# Altium project PCB_trainning.PrjPCB
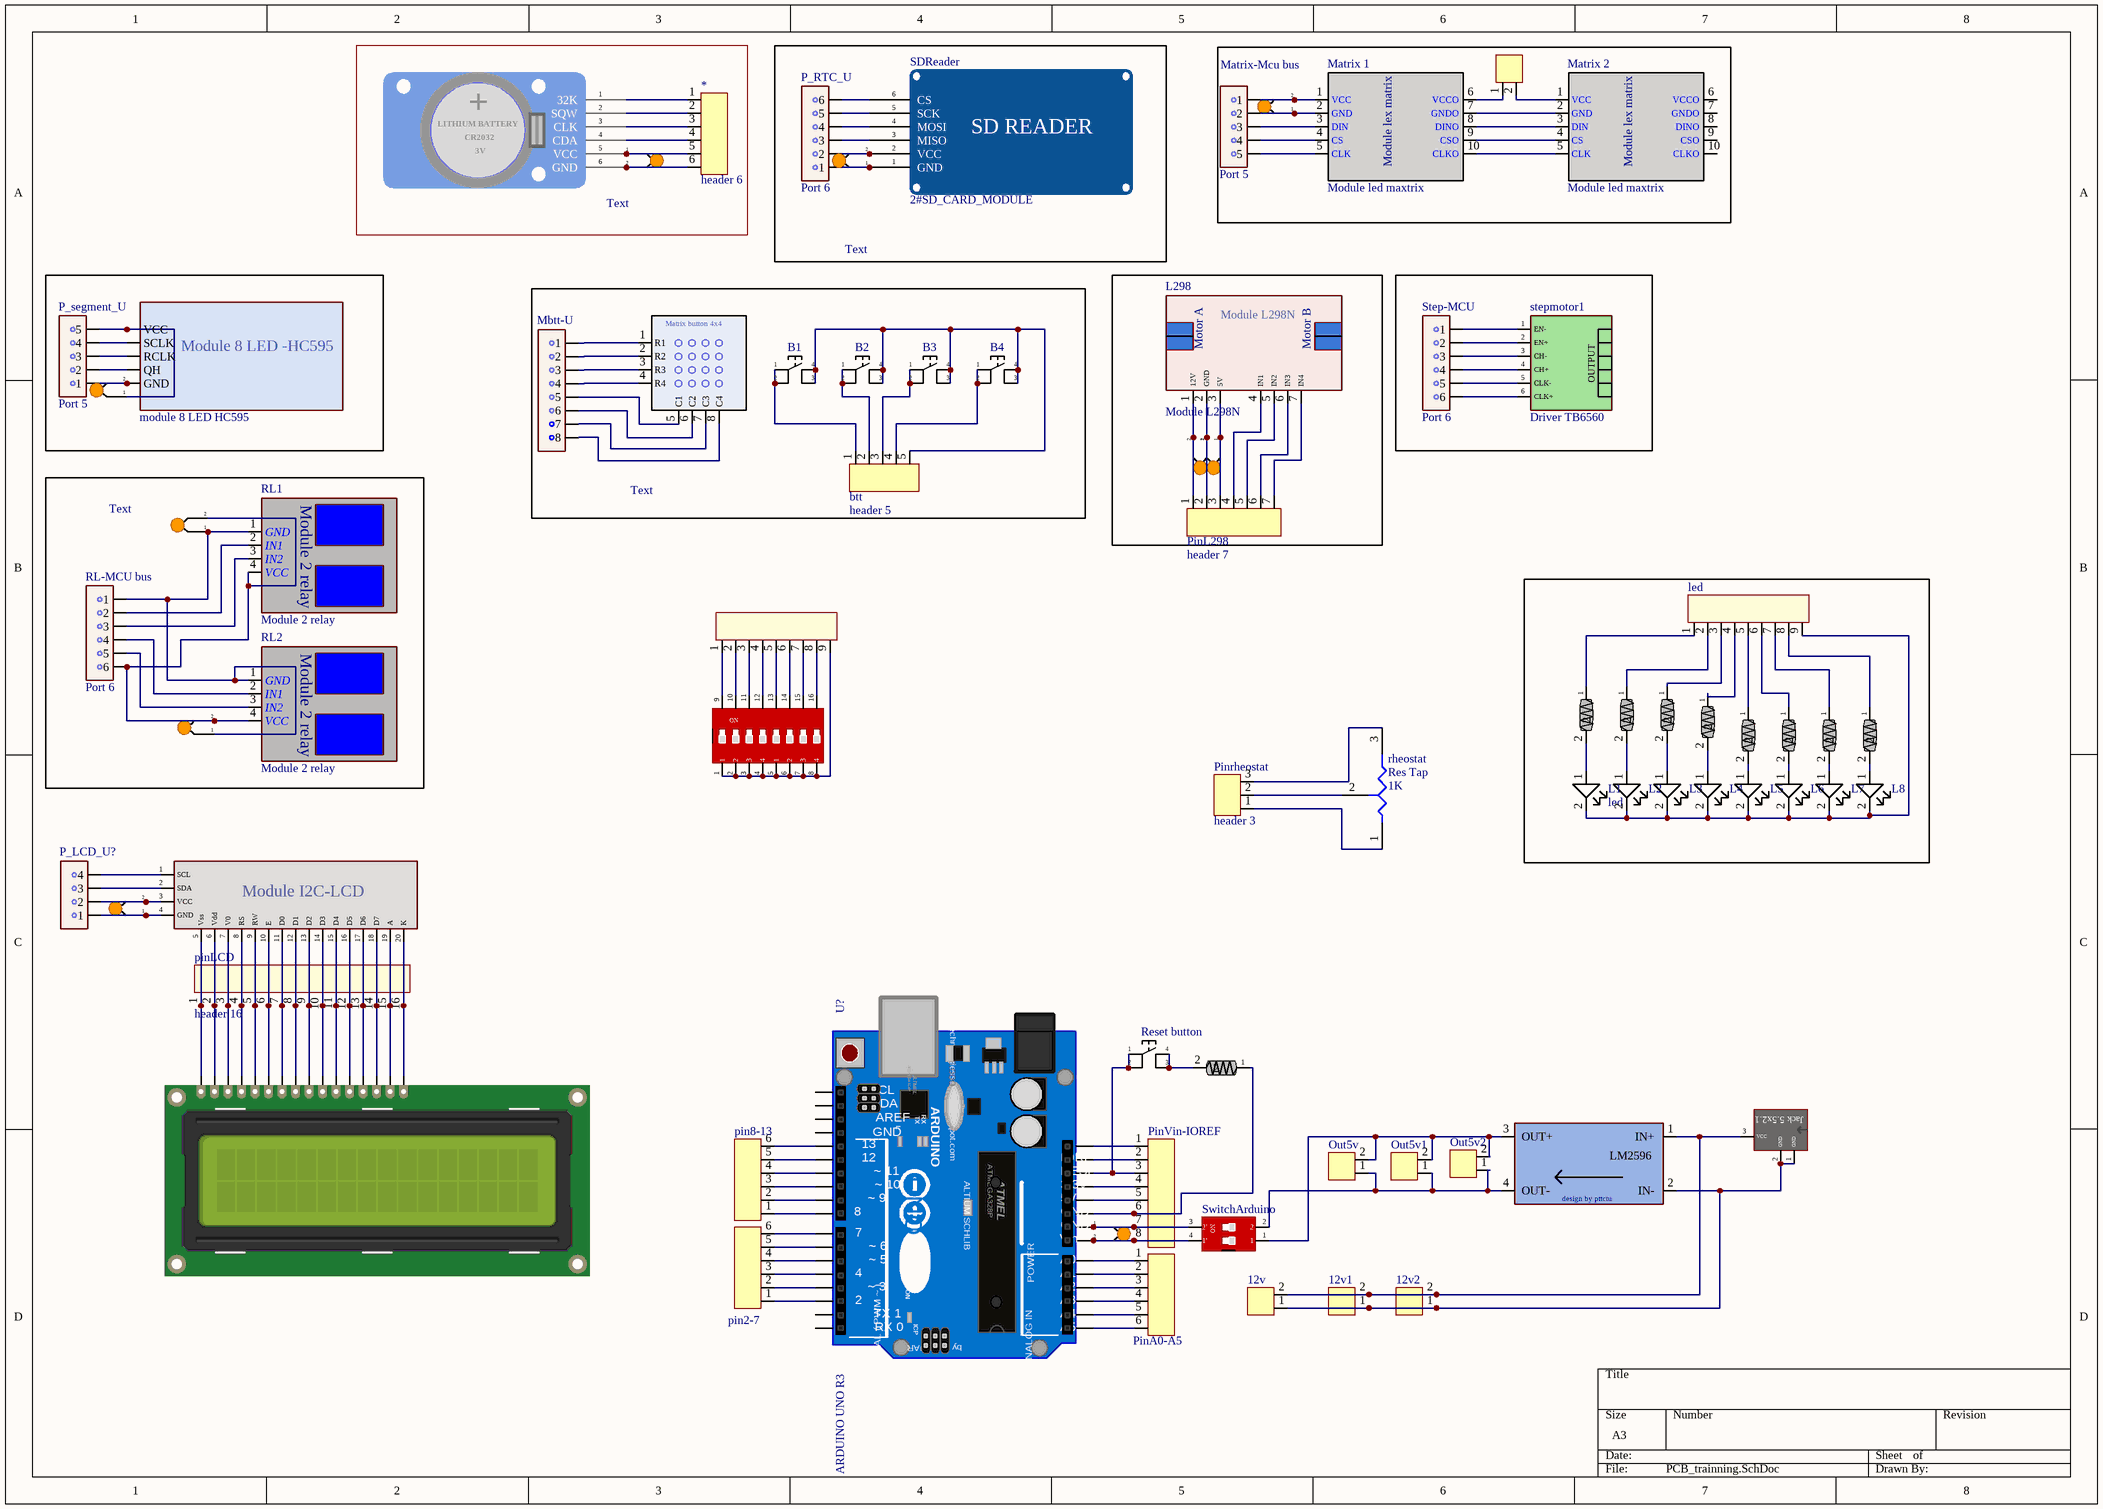
[diagram p0: PCB_trainning.SchDoc]
1 sheet, 75 parts. Net scope: global (net labels, ports and power ports of the same name join across sheets).
Board file: PCB_trainning.PcbDoc

## Sheet PCB_trainning.SchDoc
size A3

### Parts
12v  Header 2  [header2-male]  (value not drawn)
12v1  Header 2  [header2-male]  (value not drawn)
12v2  Header 2  [header2-male]  (value not drawn)
*  header 6  [header6-male]
?  module 8 LED HC595  [8 led 7 doan]
B1  5#Button  [5#Button]  (value not drawn)
B2  5#Button  [5#Button]  (value not drawn)
B3  5#Button  [5#Button]  (value not drawn)
B4  5#Button  [5#Button]  (value not drawn)
btt  header 5  [header 5- male]
connect_matrix  Header 2  [header2-male]  (value not drawn)
Converter  LM2596  [LM2596]  (value not drawn)
I2C?  Module LCD I2C  [module I2C]  (value not drawn)
L1  led  [led 5mm]
L2  led  [led 5mm]  (value not drawn)
L3  led  [led 5mm]  (value not drawn)
L4  led  [led 5mm]  (value not drawn)
L5  led  [led 5mm]  (value not drawn)
L6  led  [led 5mm]  (value not drawn)
L7  led  [led 5mm]  (value not drawn)
L8  led  [led 5mm]  (value not drawn)
L298  Module L298N  [L298N]
LCD?  JHD16A  [LCD-I2C]  (value not drawn)
led  header 9_male  [header 9]  (value not drawn)
loc  4#Cap2  [4#Cap2]  (value not drawn)
loc2  4#Cap2  [4#Cap2]  (value not drawn)
loc3  4#Cap2  [4#Cap2]  (value not drawn)
loc4  4#Cap2  [4#Cap2]  (value not drawn)
loc5  4#Cap2  [4#Cap2]  (value not drawn)
loc6  4#Cap2  [4#Cap2]  (value not drawn)
loc7  4#Cap2  [4#Cap2]  (value not drawn)
loc8  4#Cap2  [4#Cap2]  (value not drawn)
loc9  4#Cap2  [4#Cap2]  (value not drawn)
loc10  4#Cap2  [4#Cap2]  (value not drawn)
Matrix-Mcu_bus  Port 5  [header 5- male]
Matrix_1  Module led maxtrix  [8*8 LED MATRIX]
Matrix_2  Module led maxtrix  [8*8 LED MATRIX]
Matrix_button  Matrix button 4x4  [matrix btt]  (value not drawn)
Mbtt-U  port 8  [Header8-male]  (value not drawn)
Out5v  Header 2  [header2-male]  (value not drawn)
Out5v1  Header 2  [header2-male]  (value not drawn)
Out5v2  Header 2  [header2-male]  (value not drawn)
P_LCD_U?  Port 4  [Header 4-male]  (value not drawn)
P_RTC_U  Port 6  [header6-male]
P_segment_U  Port 5  [header 5- male]
pin2-7  header 6  [header6-male]  (value not drawn)
pin8-13  header 6  [header6-male]  (value not drawn)
pin-switch_8  header 9_male  [header 9]  (value not drawn)
PinA0-A5  header 6  [header6-male]  (value not drawn)
PinL298  header 7  [header7-male]
pinLCD  header 16  [header 16]
Pinrheostat  header 3  [Header3-male]
PinVin-IOREF  Header 8  [Header8-male]  (value not drawn)
Power_supply  5#DC Jack 2.54mm  [5#DC Jack 2.54mm]  (value not drawn)
R1  Res  [Res]  (value not drawn)
R2  Res  [Res]  (value not drawn)
R3  Res  [Res]  (value not drawn)
R4  Res  [Res]  (value not drawn)
R5  Res  [Res]  (value not drawn)
R6  Res  [Res]  (value not drawn)
R7  Res  [Res]  (value not drawn)
R8  Res  [Res]  (value not drawn)
Reset_button  5#Button  [5#Button]  (value not drawn)
Reset_res  Res  [Res]  (value not drawn)
rheostat  Res Tap  value 1K  [Rheostat]
RL1  Module 2 relay  [Module 2RL1]
RL2  Module 2 relay  [Module 2RL1]
RL-MCU_bus  Port 6  [header6-male]
RTC  2#RTC_DS3231  [2#RTC_DS3231]  (value not drawn)
SDReader  2#SD_CARD_MODULE  [2#SD_READER]
Step-MCU  Port 6  [header6-male]
stepmotor1  Driver TB6560  [Driver step motor TP6560]
Switch_8  Switch 8  [switch-bit8]  (value not drawn)
SwitchArduino  5#Bit_Switch_2  [5#Bit_Switch_2]  (value not drawn)
U?  ARDUINO UNO R3  [ARDUINO UNO R3 ORG]

### Blocks framed on the sheet
Text: * loc2 RTC
Text: loc4 P_RTC_U SDReader
Text: B1-B4 btt Matrix_button Mbtt-U
Text: loc6 loc7 RL1 RL2 RL-MCU_bus

### Nets
Net12v_1: 12v.1 12v1.1 12v2.1 Converter.2(IN-) Power_supply.1(GND) Power_supply.2(GND)
Net12v_2: 12v.2 12v1.2 12v2.2 Converter.1(IN+) Power_supply.3(VCC)
Net*_1: *.1 RTC.1(32K)
Net*_2: *.2 RTC.2(SQW)
Net*_3: *.3 RTC.3(CLK)
Net*_4: *.4 RTC.4(CDA)
Net*_5: *.5 loc2.1 RTC.5(VCC)
Net*_6: *.6 loc2.2 RTC.6(GND)
Net?_1: ?.1(VCC) loc3.1 P_segment_U.5
Net?_2: ?.2(SCLK) P_segment_U.4
Net?_3: ?.3(RCLK) P_segment_U.3
Net?_4: ?.4(QH) P_segment_U.2
Net?_5: ?.5(GND) loc3.2 P_segment_U.1
NetB1_1: B1.1 B1.2 btt.1
NetB1_3: B1.3 B1.4 B2.3 B2.4 B3.3 B3.4 B4.3 B4.4 btt.5
NetB2_1: B2.1 B2.2 btt.2
NetB3_1: B3.1 B3.2 btt.3
NetB4_1: B4.1 B4.2 btt.4
Netconnect_matrix_1: connect_matrix.1 Matrix_1.6(VCCO)
Netconnect_matrix_2: connect_matrix.2 Matrix_2.1(VCC)
NetConverter_3: Converter.3(OUT+) Out5v.2 Out5v1.2 Out5v2.2 SwitchArduino.1
NetConverter_4: Converter.4(OUT-) Out5v.1 Out5v1.1 Out5v2.1 SwitchArduino.2
NetI2C?_1: I2C?.1(SCL) P_LCD_U?.4
NetI2C?_2: I2C?.2(SDA) P_LCD_U?.3
NetI2C?_3: I2C?.3(VCC) loc8.2 P_LCD_U?.2
NetI2C?_4: I2C?.4(GND) loc8.1 P_LCD_U?.1
NetI2C?_5: I2C?.5(Vss) LCD?.1(GND) pinLCD.1
NetI2C?_6: I2C?.6(Vdd) LCD?.2(VCC) pinLCD.2
NetI2C?_7: I2C?.7(V0) LCD?.3(VDD) pinLCD.3
NetI2C?_8: I2C?.8(RS) LCD?.4(RS) pinLCD.4
NetI2C?_9: I2C?.9(RW) LCD?.5(RAW) pinLCD.5
NetI2C?_10: I2C?.10(E) LCD?.6(E) pinLCD.6
NetI2C?_11: I2C?.11(D0) LCD?.7(D0) pinLCD.7
NetI2C?_12: I2C?.12(D1) LCD?.8(D1) pinLCD.8
NetI2C?_13: I2C?.13(D2) LCD?.9(D2) pinLCD.9
NetI2C?_14: I2C?.14(D3) LCD?.10(D3) pinLCD.10
NetI2C?_15: I2C?.15(D4) LCD?.11(D4) pinLCD.11
NetI2C?_16: I2C?.16(D5) LCD?.12(D5) pinLCD.12
NetI2C?_17: I2C?.17(D6) LCD?.13(D6) pinLCD.13
NetI2C?_18: I2C?.18(D7) LCD?.14(D7) pinLCD.14
NetI2C?_19: I2C?.19(A) LCD?.15(BL_(+)) pinLCD.15
NetI2C?_20: I2C?.20(K) LCD?.16(BL_(-)) pinLCD.16
NetL1_1: L1.1(A) R1.2
NetL1_2: L1.2(K) L2.2(K) L3.2(K) L4.2(K) L5.2(K) L6.2(K) L7.2(K) L8.2(K) led.9
NetL2_1: L2.1(A) R2.2
NetL3_1: L3.1(A) R3.2
NetL4_1: L4.1(A) R4.2
NetL5_1: L5.1(A) R5.2
NetL6_1: L6.1(A) R6.2
NetL7_1: L7.1(A) R7.2
NetL8_1: L8.1(A) R8.2
NetL298_1: L298.1(12V) loc9.2 PinL298.1
NetL298_2: L298.2(GND) loc9.1 loc10.2 PinL298.2
NetL298_3: L298.3(5V) loc10.1 PinL298.3
NetL298_4: L298.4(IN1) PinL298.4
NetL298_5: L298.5(IN2) PinL298.5
NetL298_6: L298.6(IN3) PinL298.6
NetL298_7: L298.7(IN4) PinL298.7
Netled_1: led.1 R1.1
Netled_2: led.2 R2.1
Netled_3: led.3 R3.1
Netled_4: led.4 R4.1
Netled_5: led.5 R5.1
Netled_6: led.6 R6.1
Netled_7: led.7 R7.1
Netled_8: led.8 R8.1
Netloc4_1: loc4.1 P_RTC_U.1 SDReader.1(GND)
Netloc4_2: loc4.2 P_RTC_U.2 SDReader.2(VCC)
Netloc5_1: loc5.1 Matrix-Mcu_bus.2 Matrix_1.2(GND)
Netloc5_2: loc5.2 Matrix-Mcu_bus.1 Matrix_1.1(VCC)
Netloc6_1: loc6.1 loc7.1 RL1.1(GND) RL2.1(GND) RL-MCU_bus.1
Netloc6_2: loc6.2 loc7.2 RL1.4(VCC) RL2.4(VCC) RL-MCU_bus.6
Netloc_1: loc.1 PinVin-IOREF.7 SwitchArduino.3(2') U?.19(GND)
Netloc_2: loc.2 PinVin-IOREF.8 SwitchArduino.4(1') U?.18(Vin)
NetMatrix-Mcu_bus_3: Matrix-Mcu_bus.3 Matrix_1.3(DIN)
NetMatrix-Mcu_bus_4: Matrix-Mcu_bus.4 Matrix_1.4(CS)
NetMatrix-Mcu_bus_5: Matrix-Mcu_bus.5 Matrix_1.5(CLK)
NetMatrix_1_7: Matrix_1.7(GNDO) Matrix_2.2(GND)
NetMatrix_1_8: Matrix_1.8(DINO) Matrix_2.3(DIN)
NetMatrix_1_9: Matrix_1.9(CSO) Matrix_2.4(CS)
NetMatrix_1_10: Matrix_1.10(CLKO) Matrix_2.5(CLK)
NetMatrix_button_1: Matrix_button.1(R1) Mbtt-U.1
NetMatrix_button_2: Matrix_button.2(R2) Mbtt-U.2
NetMatrix_button_3: Matrix_button.3(R3) Mbtt-U.3
NetMatrix_button_4: Matrix_button.4(R4) Mbtt-U.4
NetMatrix_button_5: Matrix_button.5(C1) Mbtt-U.5
NetMatrix_button_6: Matrix_button.6(C2) Mbtt-U.6
NetMatrix_button_7: Matrix_button.7(C3) Mbtt-U.7
NetMatrix_button_8: Matrix_button.8(C4) Mbtt-U.8
NetP_RTC_U_3: P_RTC_U.3 SDReader.3(MISO)
NetP_RTC_U_4: P_RTC_U.4 SDReader.4(MOSI)
NetP_RTC_U_5: P_RTC_U.5 SDReader.5(SCK)
NetP_RTC_U_6: P_RTC_U.6 SDReader.6(CS)
Netpin2-7_1: pin2-7.1 U?.2
Netpin2-7_2: pin2-7.2 U?.3(~_3)
Netpin2-7_3: pin2-7.3 U?.4
Netpin2-7_4: pin2-7.4 U?.5(~_5)
Netpin2-7_5: pin2-7.5 U?.6(~_6)
Netpin2-7_6: pin2-7.6 U?.7
Netpin8-13_1: pin8-13.1 U?.8
Netpin8-13_2: pin8-13.2 U?.9(~_9)
Netpin8-13_3: pin8-13.3 U?.10(~_10)
Netpin8-13_4: pin8-13.4 U?.11(~_11)
Netpin8-13_5: pin8-13.5 U?.12
Netpin8-13_6: pin8-13.6 U?.13
Netpin-switch_8_1: pin-switch_8.1 Switch_8.9
Netpin-switch_8_2: pin-switch_8.2 Switch_8.10
Netpin-switch_8_3: pin-switch_8.3 Switch_8.11
Netpin-switch_8_4: pin-switch_8.4 Switch_8.12
Netpin-switch_8_5: pin-switch_8.5 Switch_8.13
Netpin-switch_8_6: pin-switch_8.6 Switch_8.14
Netpin-switch_8_7: pin-switch_8.7 Switch_8.15
Netpin-switch_8_8: pin-switch_8.8 Switch_8.16
Netpin-switch_8_9: pin-switch_8.9 Switch_8.1 Switch_8.2 Switch_8.3 Switch_8.4 Switch_8.5(1) Switch_8.6(2) Switch_8.7(3) Switch_8.8(4)
NetPinA0-A5_1: PinA0-A5.1 U?.A0
NetPinA0-A5_2: PinA0-A5.2 U?.A1
NetPinA0-A5_3: PinA0-A5.3 U?.A2
NetPinA0-A5_4: PinA0-A5.4 U?.A3
NetPinA0-A5_5: PinA0-A5.5 U?.A4
NetPinA0-A5_6: PinA0-A5.6 U?.A5
NetPinrheostat_1: Pinrheostat.1 rheostat.1(A)
NetPinrheostat_2: Pinrheostat.2 rheostat.2(TAP)
NetPinrheostat_3: Pinrheostat.3 rheostat.3(B)
NetPinVin-IOREF_1: PinVin-IOREF.1 U?.25
NetPinVin-IOREF_2: PinVin-IOREF.2 U?.24(IOREF)
NetPinVin-IOREF_3: PinVin-IOREF.3 Reset_button.1 Reset_button.2 U?.23(RESET)
NetPinVin-IOREF_4: PinVin-IOREF.4 U?.22(3.3V)
NetPinVin-IOREF_5: PinVin-IOREF.5 U?.21(5V)
NetPinVin-IOREF_6: PinVin-IOREF.6 Reset_res.1 U?.20(GND)
NetReset_button_3: Reset_button.3 Reset_button.4 Reset_res.2
NetRL1_2: RL1.2(IN1) RL-MCU_bus.2
NetRL1_3: RL1.3(IN2) RL-MCU_bus.3
NetRL2_2: RL2.2(IN1) RL-MCU_bus.4
NetRL2_3: RL2.3(IN2) RL-MCU_bus.5
NetStep-MCU_1: Step-MCU.1 stepmotor1.1(EN-)
NetStep-MCU_2: Step-MCU.2 stepmotor1.2(EN+)
NetStep-MCU_3: Step-MCU.3 stepmotor1.3(CH-)
NetStep-MCU_4: Step-MCU.4 stepmotor1.4(CH+)
NetStep-MCU_5: Step-MCU.5 stepmotor1.5(CLK-)
NetStep-MCU_6: Step-MCU.6 stepmotor1.6(CLK+)

Not connected (* = marked no-connect by the designer): Matrix_2 6(VCCO) 7(GNDO) 8(DINO) 9(CSO) 10(CLKO); U? 0(RX_0) 1(TX_1) 14(GND) 15(AREF) 16(SDA) 17(SCL)

### Notes on the sheet
- (in symbol 2#RTC_DS3231) LITHIUM BATTERY; +; CR2032; 3V
- (in symbol 2#SD_CARD_MODULE) SD READER
- (in symbol 5#Bit_Switch_2) ON
- (in symbol 5#DC Jack 2.54mm) Jack 5.5x2.1
- (in symbol ARDUINO UNO R3) T16.000; ATMEGA328P; ATMEL; TX; RX; L; www.technologiesstation.blogspot.com; ARDUINO; UNO; POWER; ALTIUM SCHLIB; DIGITAL ( PWM ~ ); ON; ANALOG IN; ICP; by : NANJAR
- (in symbol Driver TB6560) OUTPUT
- (in symbol LM2596) design by pttctu
- (in symbol module 8 LED HC595) Module 8 LED -HC595
- (in symbol Module L298N) Motor A; Motor B
- (in symbol Module LCD I2C) Module I2C-LCD
- (in symbol Module led maxtrix) Module lex matrix
- (in symbol Switch 8) ON

### Library data of the parts
LCD? = LCD 16X2
rheostat = Res Tap: Tapped Resistor; Sim Note: Enter the Resistance value and the set point into parameter fields.; Set Position: 0.5; Published: 24-Mar-1999; LatestRevisionDate: 17-Jul-2002; LatestRevisionNote: Re-released for DXP Platform.; PackageReference: VR3; Publisher: Altium Limited; PackageDescription: Variable Resistor, Thru-Hole; 3 Leads